# EasyEDA schematic SCH_Test_2024-06-17.json
TITLE: Sheet_1; REV: 1.0; Date: 2024-04-22; Sheet: 1/1; Drawn By: arthur.hardy69; Company: Your Company
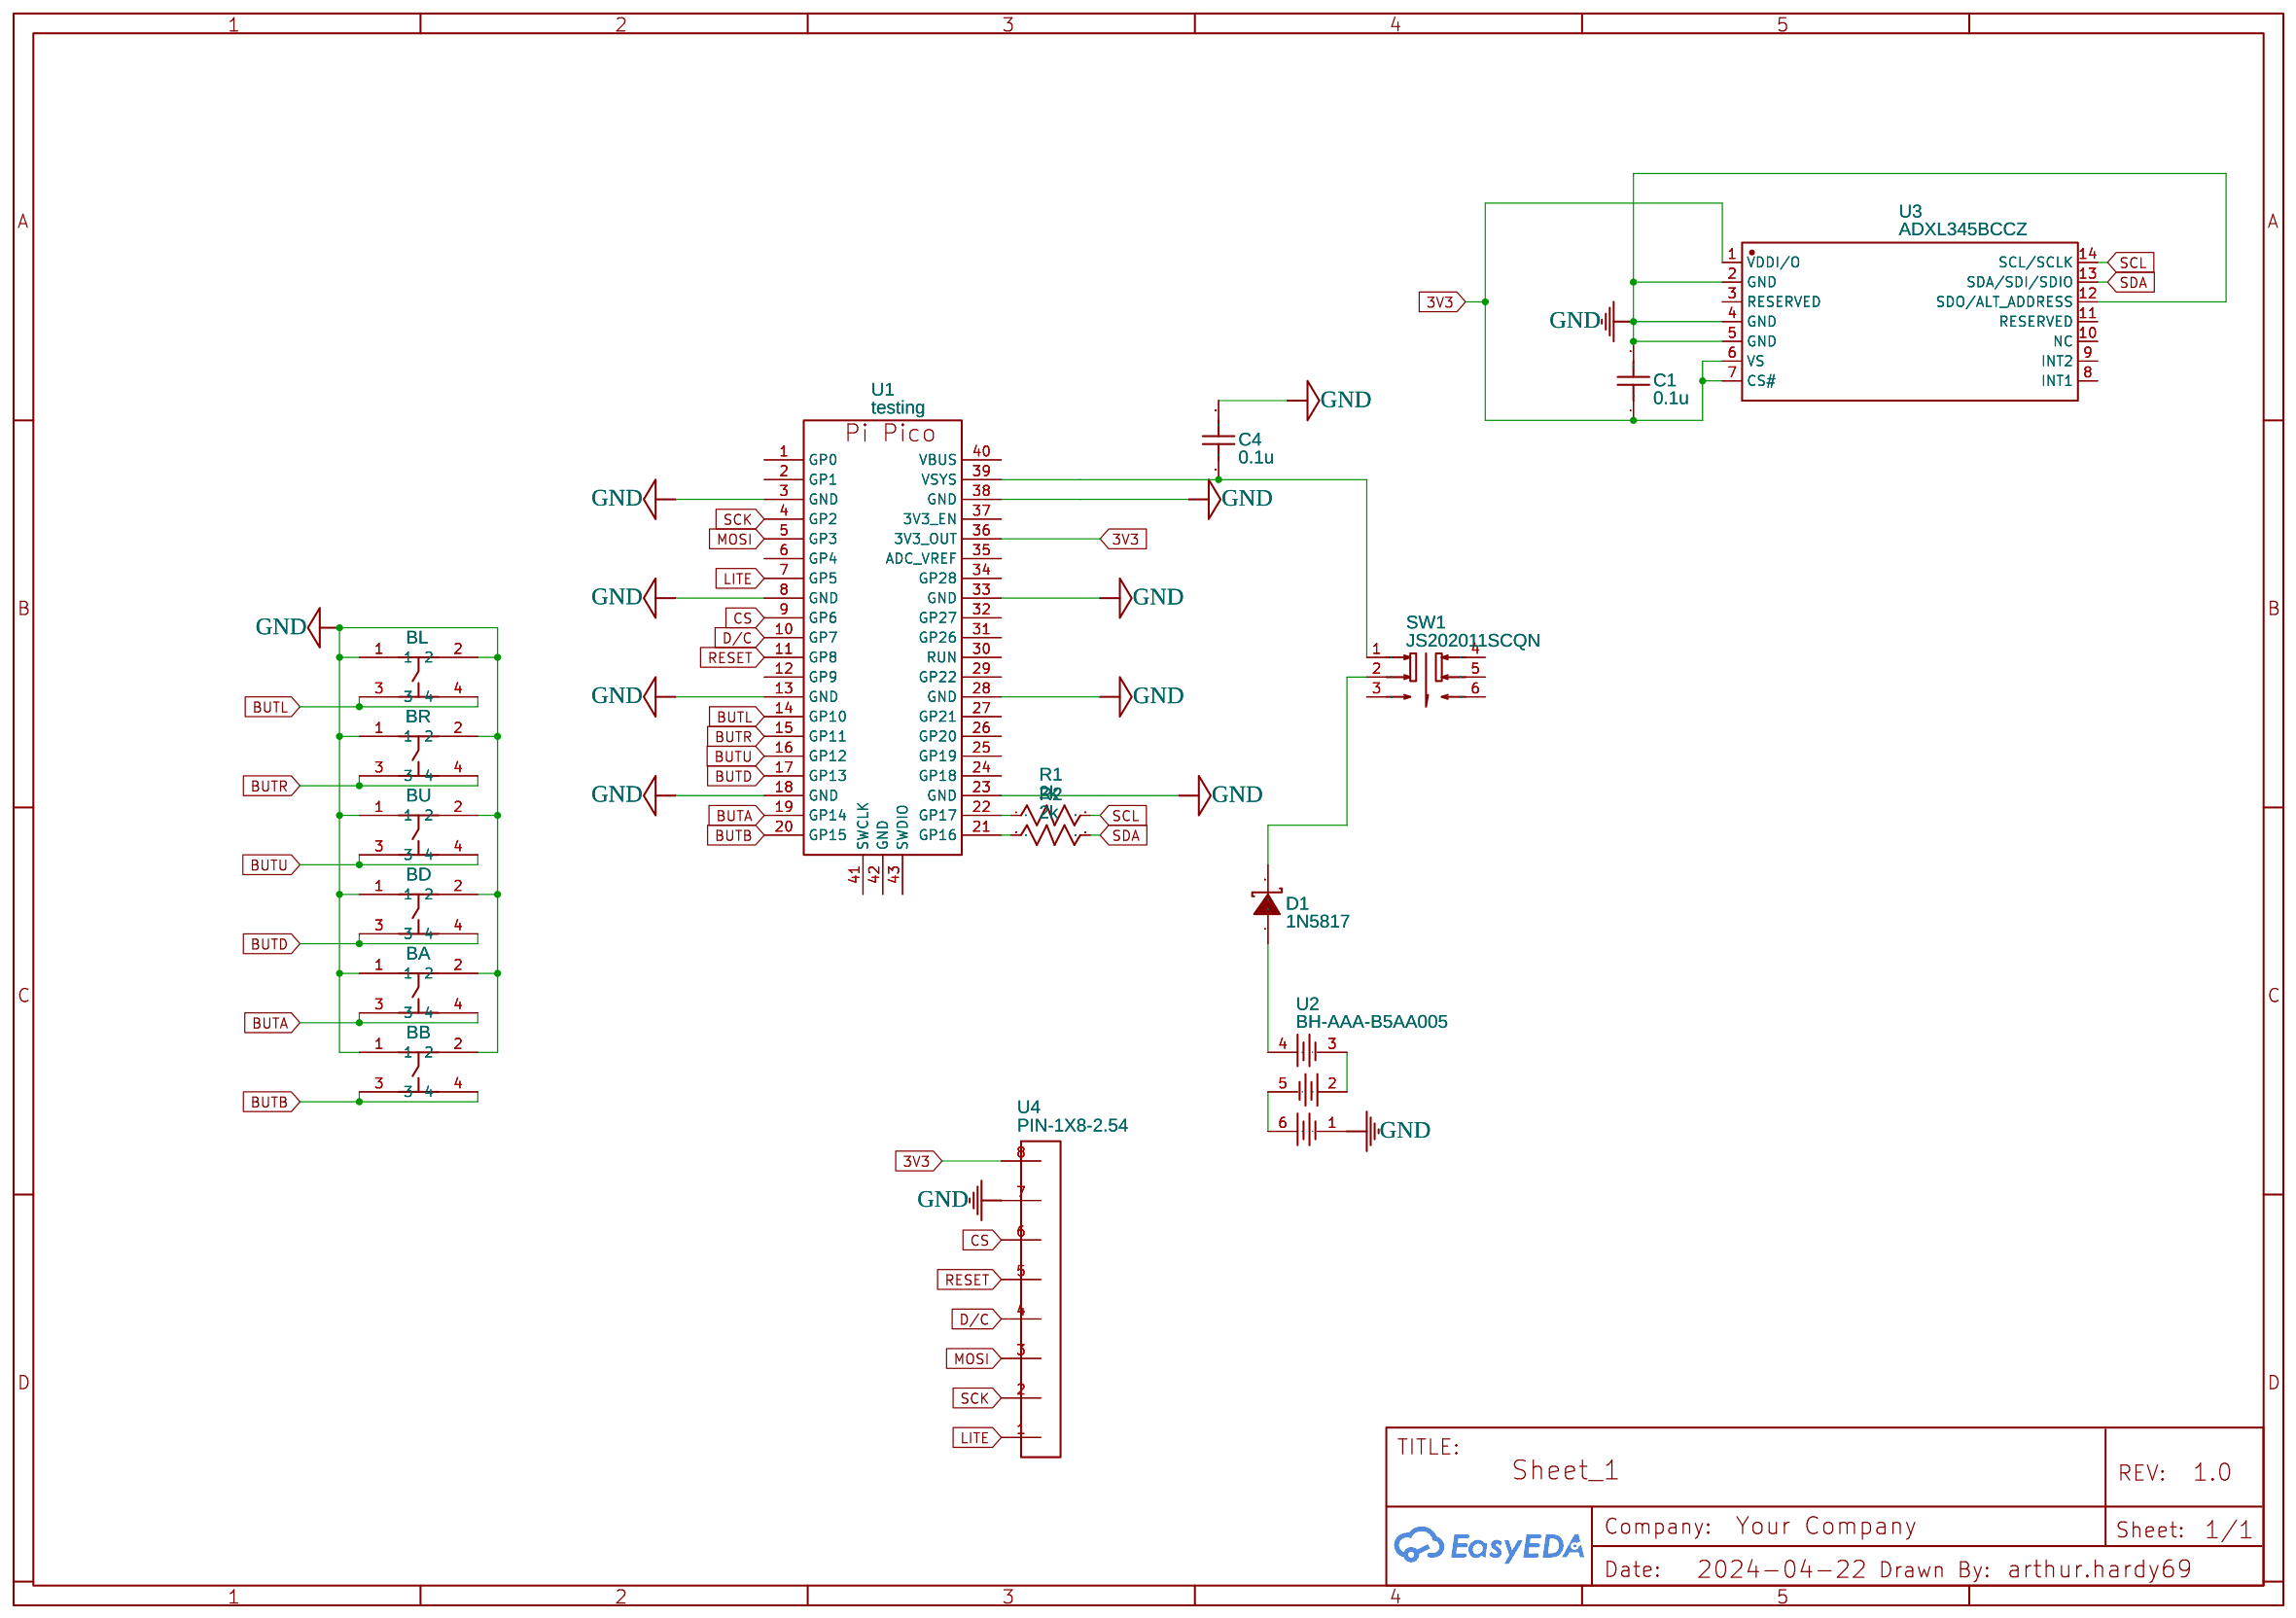
[diagram p0: schematic sheet]

## Parts
BA  A  [SOFT TACTILE BUTTON 8X8 (ADAFRUIT 3101)]
BB  B  [SOFT TACTILE BUTTON 8X8 (ADAFRUIT 3101)]
BD  Down  [SOFT TACTILE BUTTON 8X8 (ADAFRUIT 3101)]
BL  Left  [SOFT TACTILE BUTTON 8X8 (ADAFRUIT 3101)]
BR  Right  [SOFT TACTILE BUTTON 8X8 (ADAFRUIT 3101)]
BU  Up  [SOFT TACTILE BUTTON 8X8 (ADAFRUIT 3101)]
C1  0.1u  [C0603]
C4  0.1u  [C0603]
D1  1N5817  [DO-41_BD2.4-L4.7-P8.70-D0.9-FD]
R1  2k  [R0603]
R2  2k  [R0603]
SW1  JS202011SCQN  [SW-SMD_JS202011SCQN]
U1  testing  [RASPBERRY_PI_PICO_CASTELLATED]
U2  BH-AAA-B5AA005  [BAT-SMD_BH-AAA-B5AA005]
U3  ADXL345BCCZ  [LGA-14_L5.0-W3.0-P0.80-BL]
U4  PIN-1X8-2.54  [PIN-1X8-2.54]

## Library data of the parts
BA BB BD BL BR BU = Soft Tactile Button 8x8 (Adafruit 3101): Manufacturer: Adafruit; Manufacturer Part: 3101; Supplier: Mouser; Supplier Part: 485-3101; link: https://www.mouser.de/ProductDetail/Adafruit/3101?qs=IP4CA2YhK0BHSMghUFBXjQ%3D%3D; Contributor: retrust
C1 C4 = C_0603_US: Contributor: LCEDA_Lib
D1 = 1N5817: Supplier: LCSC; Manufacturer: MDD; Supplier Part: C3062; JLCPCB Part Class: Extended Part
R1 R2 = R_0603_US: Contributor: LCEDA_Lib
SW1 = JS202011SCQN: Contributor: LCSC; Supplier: LCSC; Supplier Part: C221666; Manufacturer: C&K; JLCPCB Part Class: Extended Part
U1 = testing: Manufacturer: Raspberry Pi Foundation; Manufacturer Part: Pi Pico; Supplier: Raspberry Pi; Supplier Part: Pi Pico; link: https://datasheets.raspberrypi.org/pico/pico_datasheet.pdf; Contributor: isabelma_garcia
U2 = BH-AAA-B5AA005: Contributor: lcsc; Supplier: LCSC; Supplier Part: C2979170; Manufacturer: MYOUNG(美阳); JLCPCB Part Class: Extended Part
U3 = ADXL345BCCZ: Contributor: LCSC; Supplier: LCSC; Supplier Part: C579456; Manufacturer: ADI(亚德诺); JLCPCB Part Class: Extended Part
U4 = PIN-1X8-2.54: Contributor: pelletier julien

## Nets
3V3: C1.1 U1.36(3V3_OUT) U3.1(VDDI/O) U3.6(VS) U3.7(CS#) U4.8
GND: BA.1 BA.2 BB.1 BB.2 BD.1 BD.2 BL.1 BL.2 BR.1 BR.2 BU.1 BU.2 C1.2 C4.2 U1.3(GND) U1.8(GND) U1.13(GND) U1.18(GND) U1.23(GND) U1.28(GND) U1.33(GND) U1.38(GND) U2.1(-) U3.2(GND) U3.4(GND) U3.5(GND) U3.12(SDO/ALT ADDRESS) U4.7
BUTA: BA.3 BA.4 U1.19(GP14)
BUTB: BB.3 BB.4 U1.20(GP15)
BUTD: BD.3 BD.4 U1.17(GP13)
BUTL: BL.3 BL.4 U1.14(GP10)
BUTR: BR.3 BR.4 U1.15(GP11)
BUTU: BU.3 BU.4 U1.16(GP12)
CS: U1.9(GP6) U4.6
D/C: U1.10(GP7) U4.4
LITE: U1.7(GP5) U4.1
MOSI: U1.5(GP3) U4.3
RESET: U1.11(GP8) U4.5
SCK: U1.4(GP2) U4.2
SCL: R1.2 U3.14(SCL/SCLK)
SDA: R2.2 U3.13(SDA/SDI/SDIO)
Net-(C4-1): C4.1 SW1.1 U1.39(VSYS)
Net-(D1-1): D1.1(A) U2.4(+)
Net-(D1-2): D1.2(K) SW1.2
Net-(R1-1): R1.1 U1.22(GP17)
Net-(R2-1): R2.1 U1.21(GP16)
Net-(U2-2): U2.2(+) U2.3(-)
Net-(U2-5): U2.5(-) U2.6(+)

Not connected (* = marked no-connect by the designer): SW1 3 4 5 6; U1 1(GP0) 2(GP1) 6(GP4) 12(GP9) 24(GP18) 25(GP19) 26(GP20) 27(GP21) 29(GP22) 30(RUN) 31(GP26) 32(GP27) 34(GP28) 35(ADC_VREF) 37(3V3_EN) 40(VBUS) 41(SWCLK) 42(GND) 43(SWDIO); U3 3(RESERVED) 8(INT1) 9(INT2) 10(NC) 11(RESERVED)
